# EasyEDA schematic SCH_Irrigador-Automático-Amanco_2026-02-04.json
TITLE: Irrigador Amanco; REV: 1.0; Date: 2025-06-25; Sheet: 1/1; Drawn By: João Saade; Company: João Saade
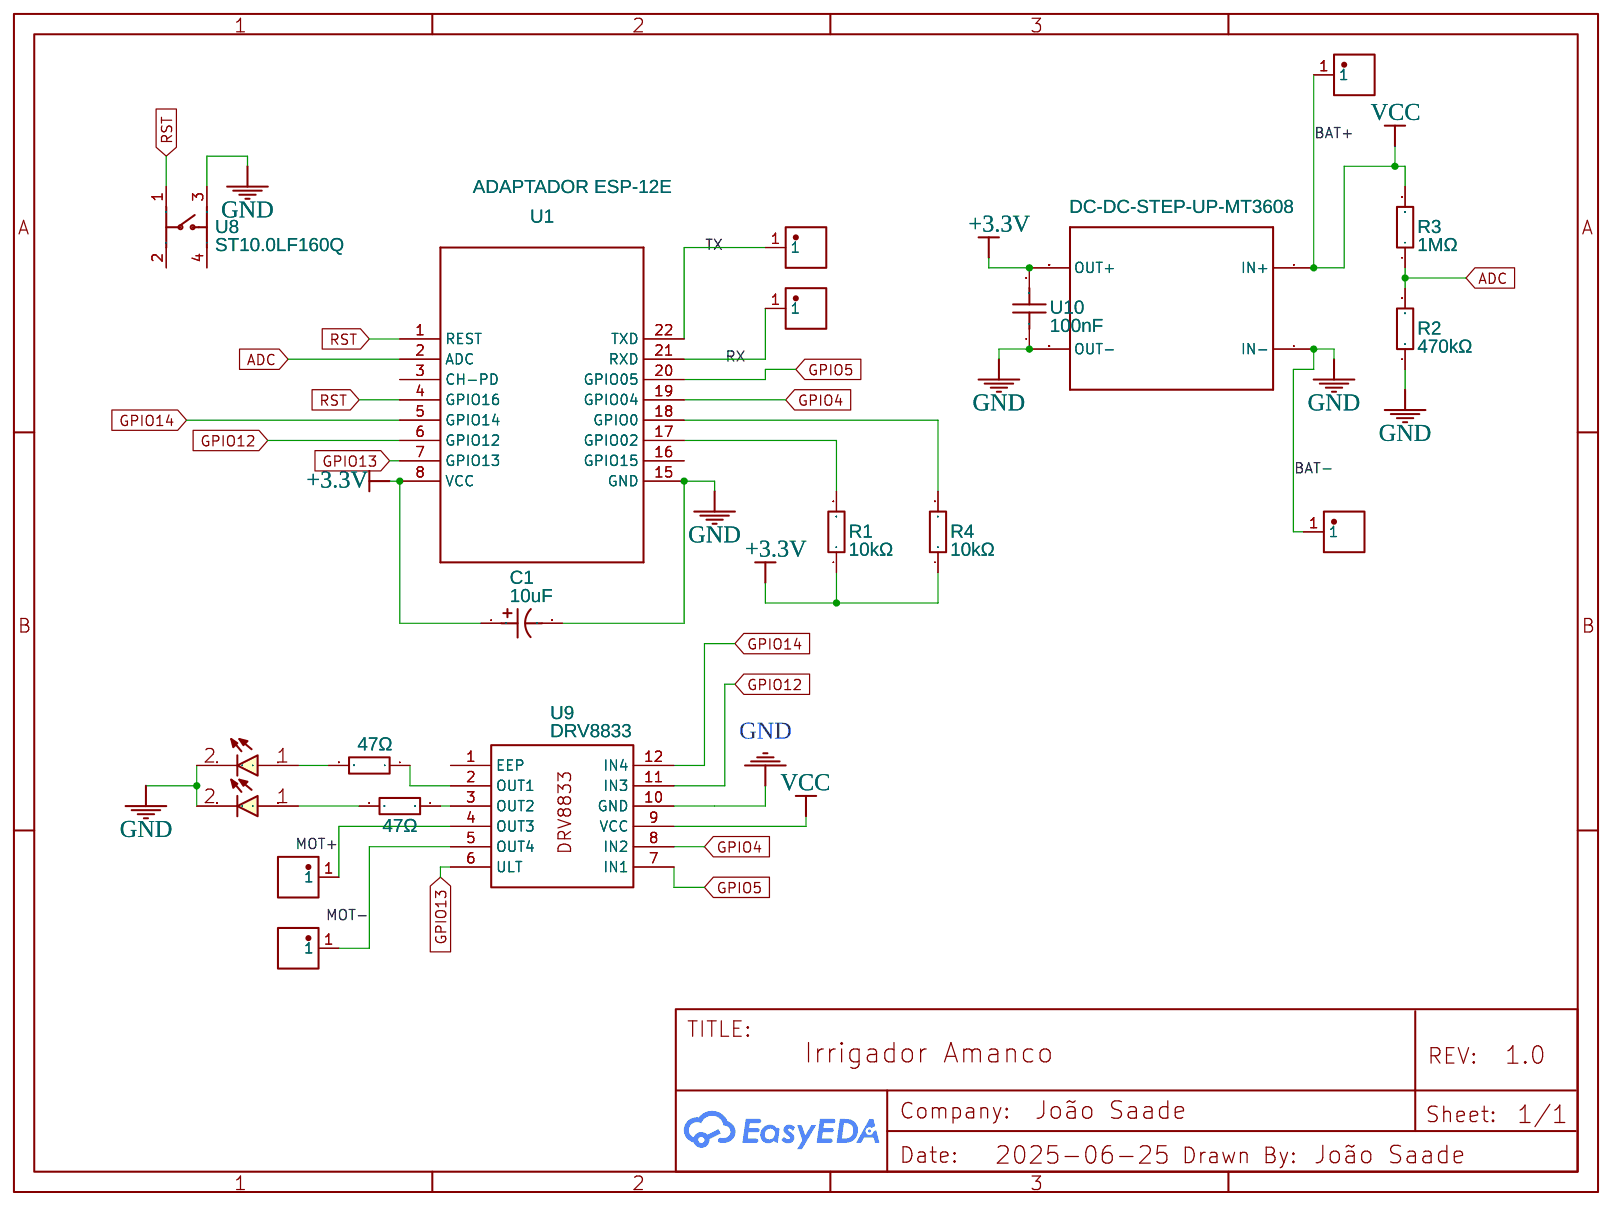
[diagram p0: schematic sheet]

## Parts
1  DC-DC-STEP-UP-MT3608  [DC-DC-STEP-UP-MT3608]
C1  10uF  [CAP-TH_BD5.0-P2.00-D0.5-FD-1]
LED1  LED-5MM-GRE  [LED-5MM-5MM]
LED2  LED-5MM-RED  [LED-5MM-5MM]
R1  10kΩ  [RES-TH_BD2.3-L6.5-P10.50-D0.5]
R2  470kΩ  [RES-TH_BD2.3-L6.5-P10.50-D0.5]
R3  1MΩ  [RES-TH_BD2.3-L6.5-P10.50-D0.5]
R4  10kΩ  [RES-TH_BD2.3-L6.5-P10.50-D0.5]
R5  47Ω  [RES-TH_BD2.3-L6.5-P10.50-D0.5]
R6  47Ω  [RES-TH_BD2.3-L6.5-P10.50-D0.5]
U1  ADAPTADOR ESP-12E  [ESP-12E_ADAPTER]
U2  P70-2200045  [TESTPOINT-TH_BD2.0-D1.0_TESTPOINT-TH_BD2.0-D1.0]
U3  P70-2200045  [TESTPOINT-TH_BD2.0-D1.0_TESTPOINT-TH_BD2.0-D1.0]
U4  P70-2200045  [TESTPOINT-TH_BD2.0-D1.0_TESTPOINT-TH_BD2.0-D1.0]
U5  P70-2200045  [TESTPOINT-TH_BD2.0-D1.0_TESTPOINT-TH_BD2.0-D1.0]
U6  P70-2200045  [TESTPOINT-TH_BD2.0-D1.0_TESTPOINT-TH_BD2.0-D1.0]
U7  P70-2200045  [TESTPOINT-TH_BD2.0-D1.0_TESTPOINT-TH_BD2.0-D1.0]
U8  ST10.0LF160Q  [SW-TH_4P-L7.2-W7.2-P4.90-LS7.5]
U9  DRV8833  [DRV8833]
U10  100nF  [CAP-TH_L3.7-W2.1-P5.08-D0.5]

## Library data of the parts
1 = DC-DC-STEP-UP-MT3608: Contributor: mratix
C1 = NXA50V10M5*11 2.5TP: Supplier: LCSC; Supplier Part: C3002459; Manufacturer: SAMYOUNG(韩国三莹); JLCPCB Part Class: Extended Part; Contributor: lcsc
LED1 = LED-5MM-GRE: Contributor: MicroRobotics
LED2 = LED-5MM-RED: Contributor: MicroRobotics
R1-R6 = CF1/4W-110KΩ±5% T52: Contributor: LCSC; Supplier: LCSC; Supplier Part: C120104; Manufacturer: CCO(千志电子); JLCPCB Part Class: Extended Part
U1 = ADAPTADOR ESP-12E: Contributor: serdarsanri
U2-U7 = P70-2200045: Supplier: LCSC; Supplier Part: C21890164; Manufacturer: Harwin; JLCPCB Part Class: Extended Part; Contributor: lcsc
U8 = ST10.0LF160Q: Contributor: lcsc; Supplier: LCSC; Supplier Part: C4364808; Manufacturer: CIT Relay and Switch
U9 = DRV8833: Manufacturer: TI; Supplier: LCSC; link: https://www.ti.com/product/DRV8833; Contributor: bin.sun148
U10 = K104K10X7RF5UH5: Contributor: lcsc; Supplier: LCSC; Supplier Part: C2979769; Manufacturer: VISHAY(威世); JLCPCB Part Class: Extended Part

## Nets
+3.3V: 1.OUT+ C1.1 R1.1 R4.1 U1.8(VCC) U10.2
ADC: R2.2 R3.1 U1.2(ADC)
BAT+: 1.IN+ R3.2 U3.1 U9.9(VCC)
BAT-: 1.IN- 1.OUT- C1.2 LED1.2(K) LED2.2(K) R2.1 U1.15(GND) U2.1 U8.3 U9.10(GND) U10.1
GPIO4: U1.19(GPIO04) U9.8(IN2)
GPIO5: U1.20(GPIO05) U9.7(IN1)
GPIO12: U1.6(GPIO12) U9.11(IN3)
GPIO13: U1.7(GPIO13) U9.6(ULT)
GPIO14: U1.5(GPIO14) U9.12(IN4)
MOT+: U6.1 U9.4(OUT3)
MOT-: U7.1 U9.5(OUT4)
RST: U1.1(REST) U1.4(GPIO16) U8.1
RX: U1.21(RXD) U5.1
TX: U1.22(TXD) U4.1
Net-(LED1-1): LED1.1(A) R5.2
Net-(LED2-1): LED2.1(A) R6.2
Net-(R1-2): R1.2 U1.17(GPIO02)
Net-(R4-2): R4.2 U1.18(GPIO0)
Net-(R5-1): R5.1 U9.2(OUT1)
Net-(R6-1): R6.1 U9.3(OUT2)

Not connected (* = marked no-connect by the designer): U1 3(CH-PD) 16(GPIO15); U8 2 4; U9 1(EEP)
